# Altium schematic sheet CH32V407WEU-R0.SchDoc
size A3; SheetNumber: 3; SheetTotal: 6
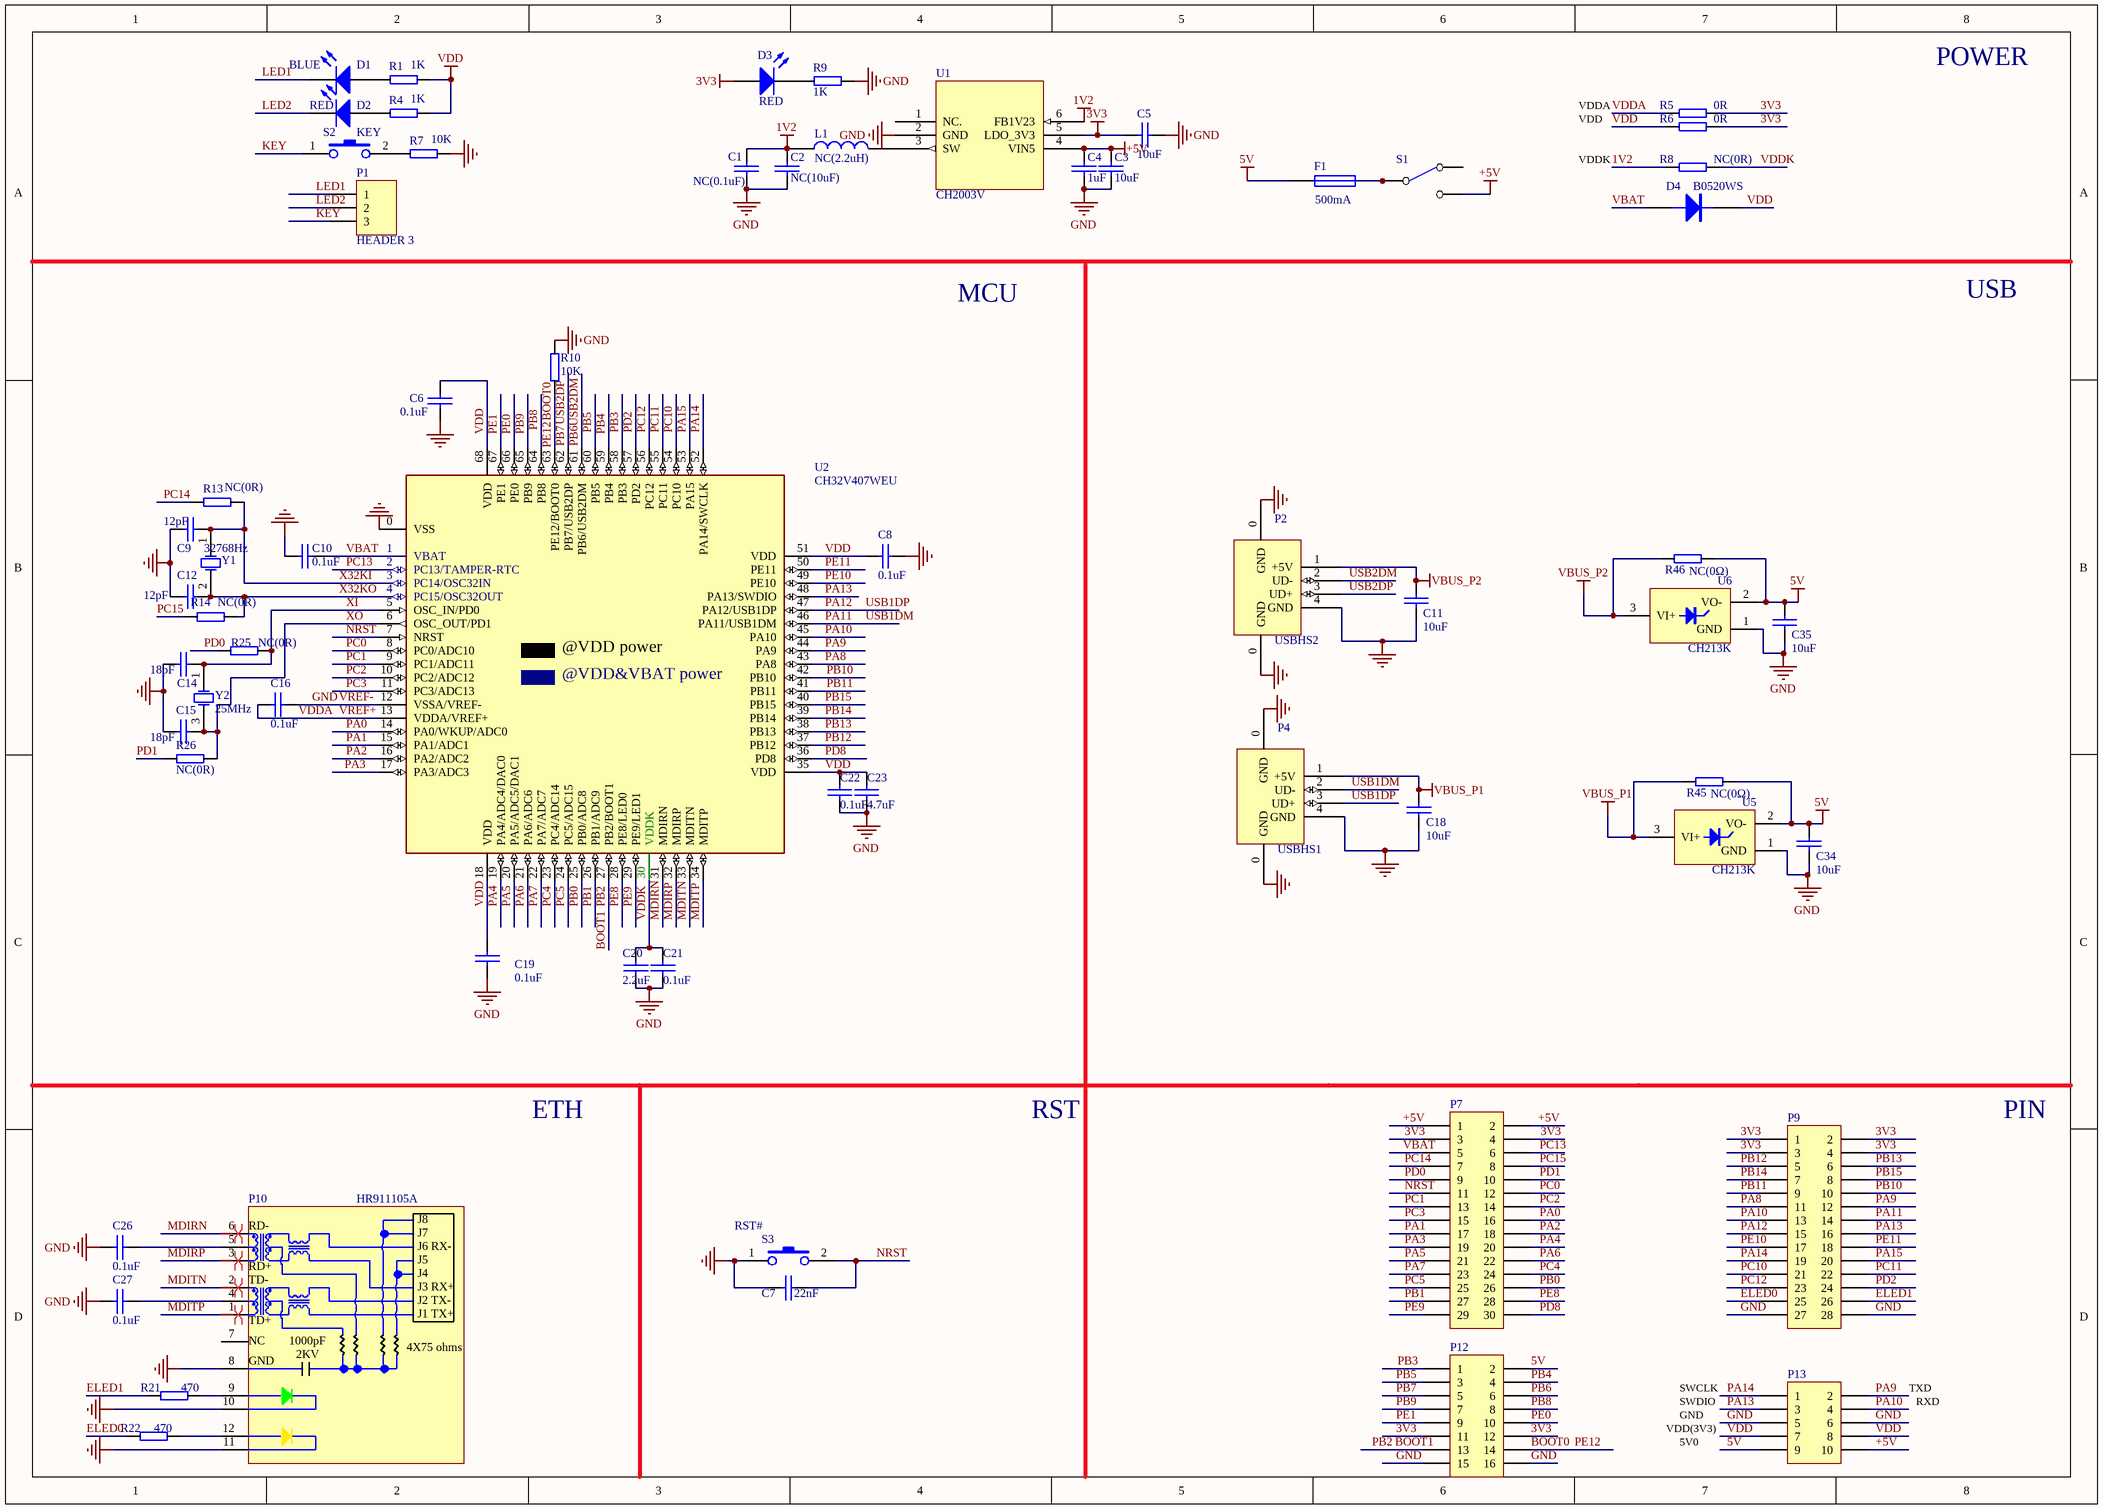
[diagram p0: CH32V407WEU-R0.SchDoc]

## Parts
C1  NC(0.1uF)  [0402_C]
C2  NC(10uF)  [0603_C]
C3  10uF  [0603_C]
C4  1uF  [0402_C]
C5  10uF  [0603_C]
C6  0.1uF  [0402_C]
C7  22nF  [0402_C]
C8  0.1uF  [0402_C]
C9  12pF  [0402_C]
C10  0.1uF  [0402_C]
C11  10uF  [0603_C]
C12  12pF  [0402_C]
C14  18pF  [0402_C]
C15  18pF  [0402_C]
C16  0.1uF  [0402_C]
C18  10uF  [0603_C]
C19  0.1uF  [0402_C]
C20  2.2uF  [0402_C]
C21  0.1uF  [0402_C]
C22  0.1uF  [0402_C]
C23  4.7uF  [0402_C]
C26  0.1uF  [0402_C]
C27  0.1uF  [0402_C]
C34  10uF  [0603_C]
C35  10uF  [0603_C]
D1  BLUE  [0603+]
D2  RED  [0603+]
D3  RED  [0603+]
D4  B0520WS  [SOD-323]
F1  500mA  [0603]
L1  NC(2.2uH)  [CD32]
P1  HEADER 3  [SIP3-2.54MM]
P2  USBHS2  [USBAF]
P4  USBHS1  [USBAF]
P7  HEADER 15x2  [IDC30-2.54MM]  (value not drawn)
P9  HEADER 14x2  [IDC28-2.54MM]  (value not drawn)
P10  HR911105A  [HR911105A]
P12  Ppin  [IDC16-2.54mm]  (value not drawn)
P13  LINK  [IDC10-2.54mm]  (value not drawn)
R1  1K  [0402]
R4  1K  [0402]
R5  0R  [0402]
R6  0R  [0402]
R7  10K  [0402]
R8  NC(0R)  [0402]
R9  1K  [0402]
R10  10K  [0402]
R13  NC(0R)  [0402]
R14  NC(0R)  [0402]
R21  470  [0402]
R22  470  [0402]
R25  NC(0R)  [0402]
R26  NC(0R)  [0402]
R45  NC(0Ω)  [0402]
R46  NC(0Ω)  [0402]
S1  SW SPDT  [SW1]  (value not drawn)
S2  KEY  [SMD_6.1x3.65x2.5mm-KEY]
S3  RST#  [SMD_6.1x3.65x2.5mm-KEY]
U1  CH2003V  [SOT-23-6]
U2  CH32V407WEU  [QFN68_8X8]
U5  CH213K  [SOT-23-3]
U6  CH213K  [SOT-23-3]
Y1  32768Hz  [FC-135]
Y2  25MHz  [XT3225]

## Nets
1V2: C1.2 C2.2 L1.2 R8.2 U1.6(FB1V23)
3V3: C5.2 D3.1(A) P7.3 P7.4 P9.1 P9.2 P9.3 P9.4 P12.11 P12.12 R5.1 R6.1 U1.5(LDO_3V3)
5V: C34.1 C35.1 F1.1 P12.2 P13.9 R45.1 R46.1 U5.2(VO-) U6.2(VO-)
+5V: C3.2 C4.2 P7.1 P7.2 P13.10 S1.2(NC) U1.4(VIN5)
GND: C1.1 C2.1 C3.1 C4.1 C5.1 C6.1 C7.1 C8.2 C9.1 C10.1 C11.2 C12.1 C14.1 C15.1 C16.2 C18.2 C19.1 C20.1 C21.1 C22.1 C23.1 C26.1 C27.1 C34.2 C35.2 P2.0(GND) P2.4(GND) P4.0(GND) P4.4(GND) P9.27 P9.28 P10.8 P10.10 P10.11 P12.15 P12.16 P13.5 P13.6 R7.1 R9.2 R10.1 S3.1 U1.2(GND) U2.0(VSS) U2.12(VSSA/VREF-) U5.1(GND) U6.1(GND)  [also labelled VREF-]
VBUS_P1: C18.1 P4.1(+5V) R45.2 U5.3(VI+)
VBUS_P2: C11.1 P2.1(+5V) R46.2 U6.3(VI+)
VDD: C6.2 C8.1 C19.2 C22.2 C23.2 D4.2(K) P13.7 P13.8 R1.1 R4.1 R6.2 U2.18(VDD) U2.35(VDD) U2.51(VDD) U2.68(VDD)
BOOT0: P12.14 R10.2 U2.63(PE12/BOOT0)  [also labelled PE12]
BOOT1: P12.13 U2.27(PB2/BOOT1)  [also labelled PB2]
ELED0: P9.25 R22.1
ELED1: P9.26 R21.1
KEY: P1.3 S2.1
LED1: D1.2(K) P1.1
LED2: D2.2(K) P1.2
MDIRN: P10.6 U2.31(MDIRN)
MDIRP: P10.3 U2.32(MDIRP)
MDITN: P10.2 U2.33(MDITN)
MDITP: P10.1 U2.34(MDITP)
NRST: C7.2 P7.11 S3.2 U2.7(NRST)
PA0: P7.16 U2.14(PA0/WKUP/ADC0)
PA1: P7.17 U2.15(PA1/ADC1)
PA2: P7.18 U2.16(PA2/ADC2)
PA3: P7.19 U2.17(PA3/ADC3)
PA4: P7.20 U2.19(PA4/ADC4/DAC0)
PA5: P7.21 U2.20(PA5/ADC5/DAC1)
PA6: P7.22 U2.21(PA6/ADC6)
PA7: P7.23 U2.22(PA7/ADC7)
PA8: P9.11 U2.43(PA8)
PA9: P9.12 P13.2 U2.44(PA9)
PA10: P9.13 P13.4 U2.45(PA10)
PA11: P4.2(UD-) P9.14 U2.46(PA11/USB1DM)  [also labelled USB1DM]
PA12: P4.3(UD+) P9.15 U2.47(PA12/USB1DP)  [also labelled USB1DP]
PA13: P9.16 P13.3 U2.48(PA13/SWDIO)
PA14: P9.19 P13.1 U2.52(PA14/SWCLK)
PA15: P9.20 U2.53(PA15)
PB0: P7.26 U2.25(PB0/ADC8)
PB1: P7.27 U2.26(PB1/ADC9)
PB3: P12.1 U2.58(PB3)
PB4: P12.4 U2.59(PB4)
PB5: P12.3 U2.60(PB5)
PB6: P2.2(UD-) P12.6 U2.61(PB6/USB2DM)  [also labelled USB2DM]
PB7: P2.3(UD+) P12.5 U2.62(PB7/USB2DP)  [also labelled USB2DP]
PB8: P12.8 U2.64(PB8)
PB9: P12.7 U2.65(PB9)
PB10: P9.10 U2.42(PB10)
PB11: P9.9 U2.41(PB11)
PB12: P9.5 U2.37(PB12)
PB13: P9.6 U2.38(PB13)
PB14: P9.7 U2.39(PB14)
PB15: P9.8 U2.40(PB15)
PC0: P7.12 U2.8(PC0/ADC10)
PC1: P7.13 U2.9(PC1/ADC11)
PC2: P7.14 U2.10(PC2/ADC12)
PC3: P7.15 U2.11(PC3/ADC13)
PC4: P7.24 U2.23(PC4/ADC14)
PC5: P7.25 U2.24(PC5/ADC15)
PC10: P9.21 U2.54(PC10)
PC11: P9.22 U2.55(PC11)
PC12: P9.23 U2.56(PC12)
PC13: P7.6 U2.2(PC13/TAMPER-RTC)
PC14: P7.7 R13.1
PC15: P7.8 R14.1
PD0: P7.9 R25.1
PD1: P7.10 R26.2
PD2: P9.24 U2.57(PD2)
PD8: P7.30 U2.36(PD8)
PE0: P12.10 U2.66(PE0)
PE1: P12.9 U2.67(PE1)
PE8: P7.28 U2.28(PE8/LED0)
PE9: P7.29 U2.29(PE9/LED1)
PE10: P9.17 U2.49(PE10)
PE11: P9.18 U2.50(PE11)
VBAT: C10.2 D4.1(A) P7.5 U2.1(VBAT)
VDDA: C16.1 R5.2 U2.13(VDDA/VREF+)  [also labelled VREF+]
VDDK: C20.2 C21.2 R8.1 U2.30(VDDK)
X32KI: C9.2 R13.2 U2.3(PC14/OSC32IN) Y1.1(OSC1)
X32KO: C12.2 R14.2 U2.4(PC15/OSC32OUT) Y1.2(OSC2)
XI: C14.2 R25.2 U2.5(OSC_IN/PD0) Y2.1(OSC1)
XO: C15.2 R26.1 U2.6(OSC_OUT/PD1) Y2.3(OSC2)
NetC26_2: C26.2 P10.5
NetC27_2: C27.2 P10.4
NetD1_1: D1.1(A) R1.2
NetD2_1: D2.1(A) R4.2
NetD3_2: D3.2(K) R9.1
NetF1_2: F1.2 S1.1(COMMON)
NetL1_1: L1.1 U1.3(SW)
NetP10_9: P10.9 R21.2
NetP10_12: P10.12 R22.2
NetR7_2: R7.2 S2.2

Not connected (* = marked no-connect by the designer): P10 7; S1 3(NO); U1 1(NC.)

## Layout directives
differential pair: MDIRN, MDIRP, MDITN, MDITP

## Notes on the sheet
- VDDA
- POWER
- VDDK
- VDD
- MCU
- USB
- ETH
- RST
- PIN
- SWCLK
- TXD
- VDD(3V3)
- SWDIO
- 5V0
- GND
- RXD
- (in symbol CH32V407WEU) @VDD power; @VDD&VBAT power
- (in symbol HR911105A) J8; RD-; J7; J6; RX-; J5; RD+; J4; TD-; J3; RX+; J2; TX-; J1; TX+; TD+; NC; 1000pF; 4X75 ohms; 2KV; GND

## Library data of the parts
C1-C12 C14-C16 C18-C23 C26 C27 C34 C35 = CAP: Capacitor
D1-D3 = LED0: Typical INFRARED GaAs LED; Published: 8-Jun-2000; LatestRevisionDate: 08-Jul-2005; LatestRevisionNote: Mech Layer 1 removed.; PackageReference: LED-0; Publisher: Altium Limited; PackageDescription: LED; 2 Leads
D4 = DIODE
F1 = FUSE1: Fuse
L1 = INDUCTOR
P1 = HEADER 3: Header, 3-Pin
P2 P4 = USB: USB Port
P7 = HEADER 15x2: Header, 15-Pin, Dual row
P9 = HEADER 14x2: Header, 14-Pin, Dual row
P12 = Header 8X2H: Header, 8-Pin, Dual row, Right Angle; LatestRevisionDate: 17-Jul-2002; LatestRevisionNote: Re-released for DXP Platform.; Publisher: Altium Limited
P13 = Header 5X2H: Header, 5-Pin, Dual row, Right Angle; LatestRevisionDate: 17-Jul-2002; LatestRevisionNote: Re-released for DXP Platform.; Publisher: Altium Limited
R1 R4 R7 R9 R10 R13 R14 R21 R22 R25 R26 R45 R46 = RES
R5 R6 R8 = R
S2 S3 = KEY1
U1 = CH2003V: Step-Down DC-DC Converter, 5V input, 1.23V * 800mA output, with LDO 3.3V * 200mA
U2 = CH32V407WEU: RISC-V FPU HD-MCU, 175MHz, USB_480M, 100M Ethernet & Phy, CAN, ADC, DAC
U5 U6 = CH213K: Ideal Diode 5V*1A
Y1 Y2 = XTAL: Crystal Oscillator; Published: 8-Jun-2000; LatestRevisionDate: 17-Jul-2002; LatestRevisionNote: Re-released for DXP Platform.; PackageReference: R38; Publisher: Altium Limited; PackageDescription: Crystal, Thru-Hole; 2 Leads; Body 3.1 x 8.2 mm (Dia.xH)